# Altium schematic sheet sourcePCB_test.SchDoc
size A4
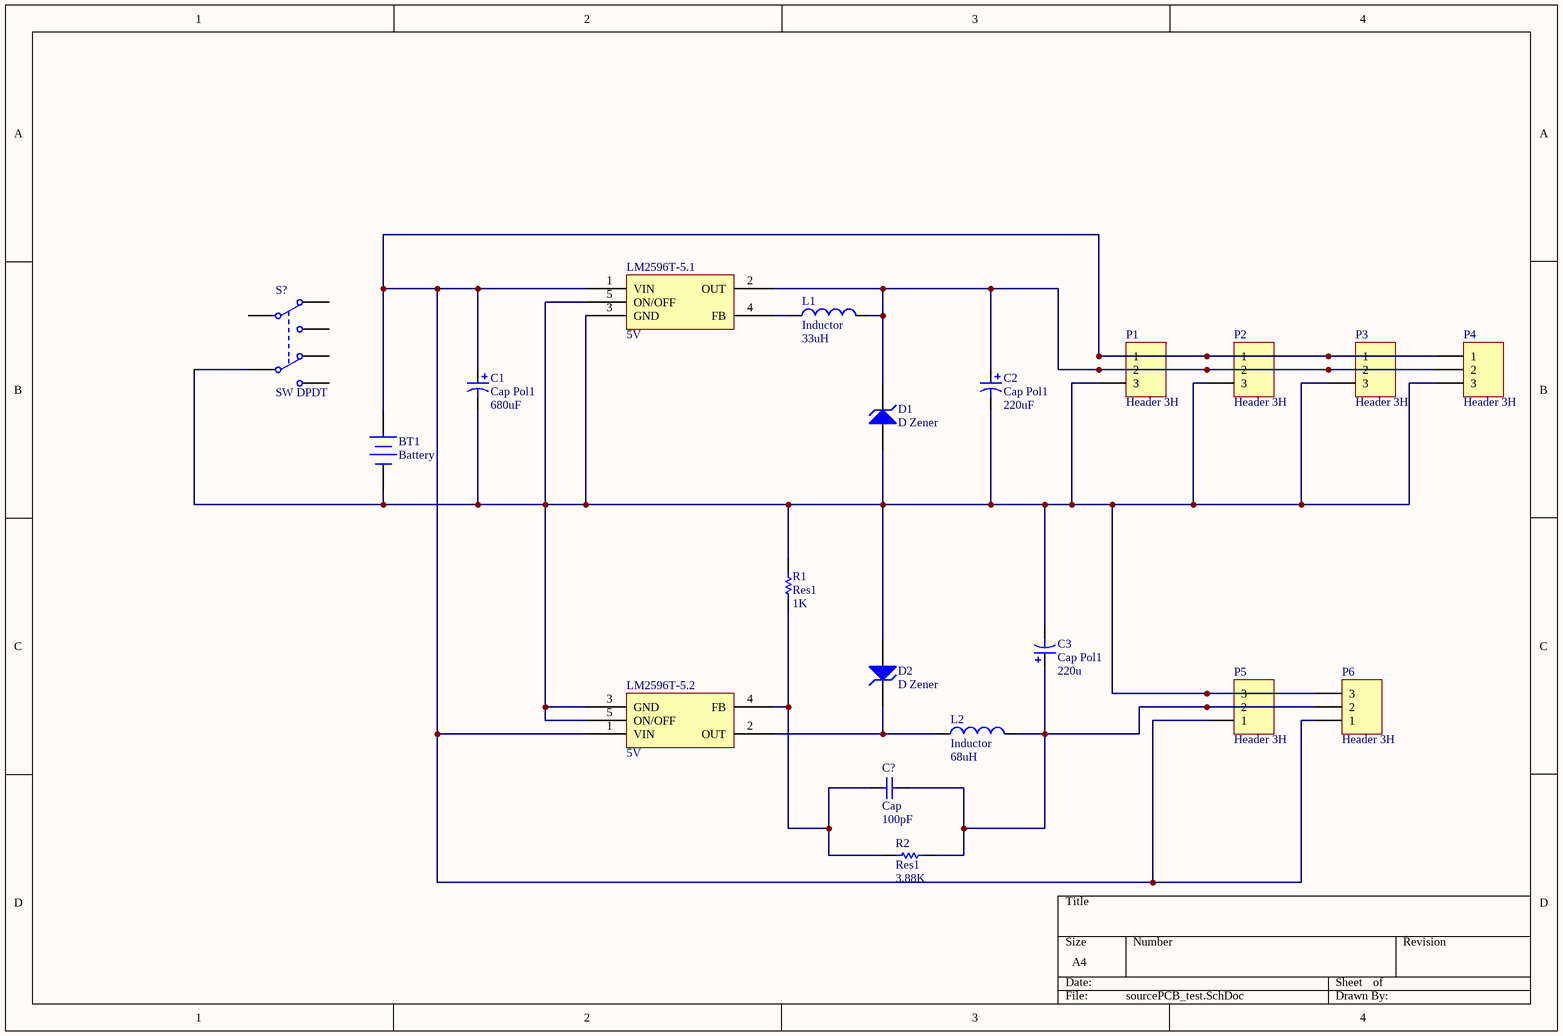
[diagram p0: sourcePCB_test.SchDoc]

## Parts
BT1  Battery  [BAT-2]
C1  Cap Pol1  value 680uF  [RB7.6-15]
C2  Cap Pol1  value 220uF  [RB7.6-15]
C3  Cap Pol1  value 220u  [RB7.6-15]
C?  Cap  value 100pF  [RAD-0.3]
D1  D Zener  [DIODE-0.7]
D2  D Zener  [DIODE-0.7]
L1  Inductor  value 33uH  [0402-A]
L2  Inductor  value 68uH  [0402-A]
LM2596T-5.1  5V  [LM2596T-5.0]
LM2596T-5.2  5V  [LM2596T-5.0]
P1  Header 3H  [HDR1X3H]
P2  Header 3H  [HDR1X3H]
P3  Header 3H  [HDR1X3H]
P4  Header 3H  [HDR1X3H]
P5  Header 3H  [HDR1X3H]
P6  Header 3H  [HDR1X3H]
R1  Res1  value 1K  [AXIAL-0.3]
R2  Res1  value 3.88K  [AXIAL-0.3]
S?  SW DPDT  [SOT23-6_N]

## Nets
NetBT1_1: BT1.1(+) C1.1 LM2596T-5.1.1(VIN) LM2596T-5.2.1(VIN) P1.1 P2.1 P3.1 P4.1 P5.1 P6.1
NetBT1_2: BT1.2(-) C1.2 C2.2 C3.2 D1.1(A) D2.1(A) LM2596T-5.1.3(GND) LM2596T-5.1.5(ON/OFF) LM2596T-5.2.3(GND) LM2596T-5.2.5(ON/OFF) P1.3 P2.3 P3.3 P4.3 P5.3 P6.3 R1.2 S?.5(COMMON2)
NetC2_1: C2.1 D1.2(K) L1.2 LM2596T-5.1.2(OUT) P1.2 P2.2 P3.2 P4.2
NetC3_1: C3.1 C?.2 L2.2 P5.2 P6.2 R2.2
NetC?_1: C?.1 LM2596T-5.2.4(FB) R1.1 R2.1
NetD2_2: D2.2(K) L2.1 LM2596T-5.2.2(OUT)
NetL1_1: L1.1 LM2596T-5.1.4(FB)

Not connected (* = marked no-connect by the designer): S? 1(COMMON1) 2(NC1) 3(NO1) 4(NC2) 6(NO2)

## Library data of the parts
BT1 = Battery: Multicell Battery; Published: 24-Mar-1999; LatestRevisionDate: 17-Jul-2002; LatestRevisionNote: Re-released for DXP Platform.; PackageReference: BAT-2; Publisher: Altium Limited; PackageDescription: Battery; 2 Leads
C1-C3 = Cap Pol1: Polarized Capacitor (Radial); Published: 8-Jun-2000; LatestRevisionDate: 17-Jul-2002; LatestRevisionNote: Re-released for DXP Platform.; PackageReference: RB7.6-15; Publisher: Altium Limited; PackageDescription: Polarized Capacitor (Radial); 2 Leads
C? = Cap: Capacitor; Published: 8-Jun-2000; LatestRevisionDate: 17-Jul-2002; LatestRevisionNote: Re-released for DXP Platform.; PackageReference: RAD-0.3; Publisher: Altium Limited; PackageDescription: Radial Cap, Thru-Hole; 2 Leads; 0.3 in Pin Spacing
D1 D2 = D Zener: Zener Diode; Published: 8-Jun-2000; LatestRevisionDate: 17-Jul-2002; LatestRevisionNote: Re-released for DXP Platform.; PackageReference: DIODE-0.7; Publisher: Altium Limited; PackageDescription: Diode, Thru-Hole; 2 Leads; 0.7 in Pin Spacing
L1 L2 = Inductor: Code_IEC: 1005; Published: 8-Jun-2000; LatestRevisionDate: 29-May-2009; LatestRevisionNote: IPC-7351 Footprint Added.; PackageReference: 0402-A; Publisher: Altium Limited; PackageDescription: Chip Inductor; Code_JEITA: 0402
LM2596T-5.1 LM2596T-5.2 = LM2596T-5.0
P1-P6 = Header 3H: Header, 3-Pin, Right Angle; LatestRevisionDate: 17-Jul-2002; LatestRevisionNote: Re-released for DXP Platform.; Publisher: Altium Limited
R1 R2 = Res1: Resistor; Published: 8-Jun-2000; LatestRevisionDate: 17-Jul-2002; LatestRevisionNote: Re-released for DXP Platform.; PackageReference: AXIAL-0.3; Publisher: Altium Limited; PackageDescription: Axial Device, Thru-Hole; 2 Leads; 0.3 in Pin Spacing
S? = SW DPDT: Switch; Published: 24-Mar-1999; LatestRevisionDate: 29-May-2009; LatestRevisionNote: IPC-7351 Footprint Added.; PackageVersion: Mar-2001; PackageReference: SOT23-6; Publisher: Altium Limited; PackageDescription: 6-Pin SOT-23 Package 0.95 mm Pitch, 2.7 mm Lead Span; Code_JEITA: SC-74; Code_IPC: SOT26A-6